# EasyEDA Pro project GController.eprj, schematic GController, sheets 1 to 3 of 4

## Sheets
1 PowerSupply: Create Date: 2024-08-13; Page Name: PowerSupply; Project Name: GController; Schematic Name: GController; Update Date: 2024-08-26; Company: Mark; Drawn: Naren Subburaj; Page Size: A3; Part Number: 001; Reviewed: Naren Subburaj; Version: V0.1
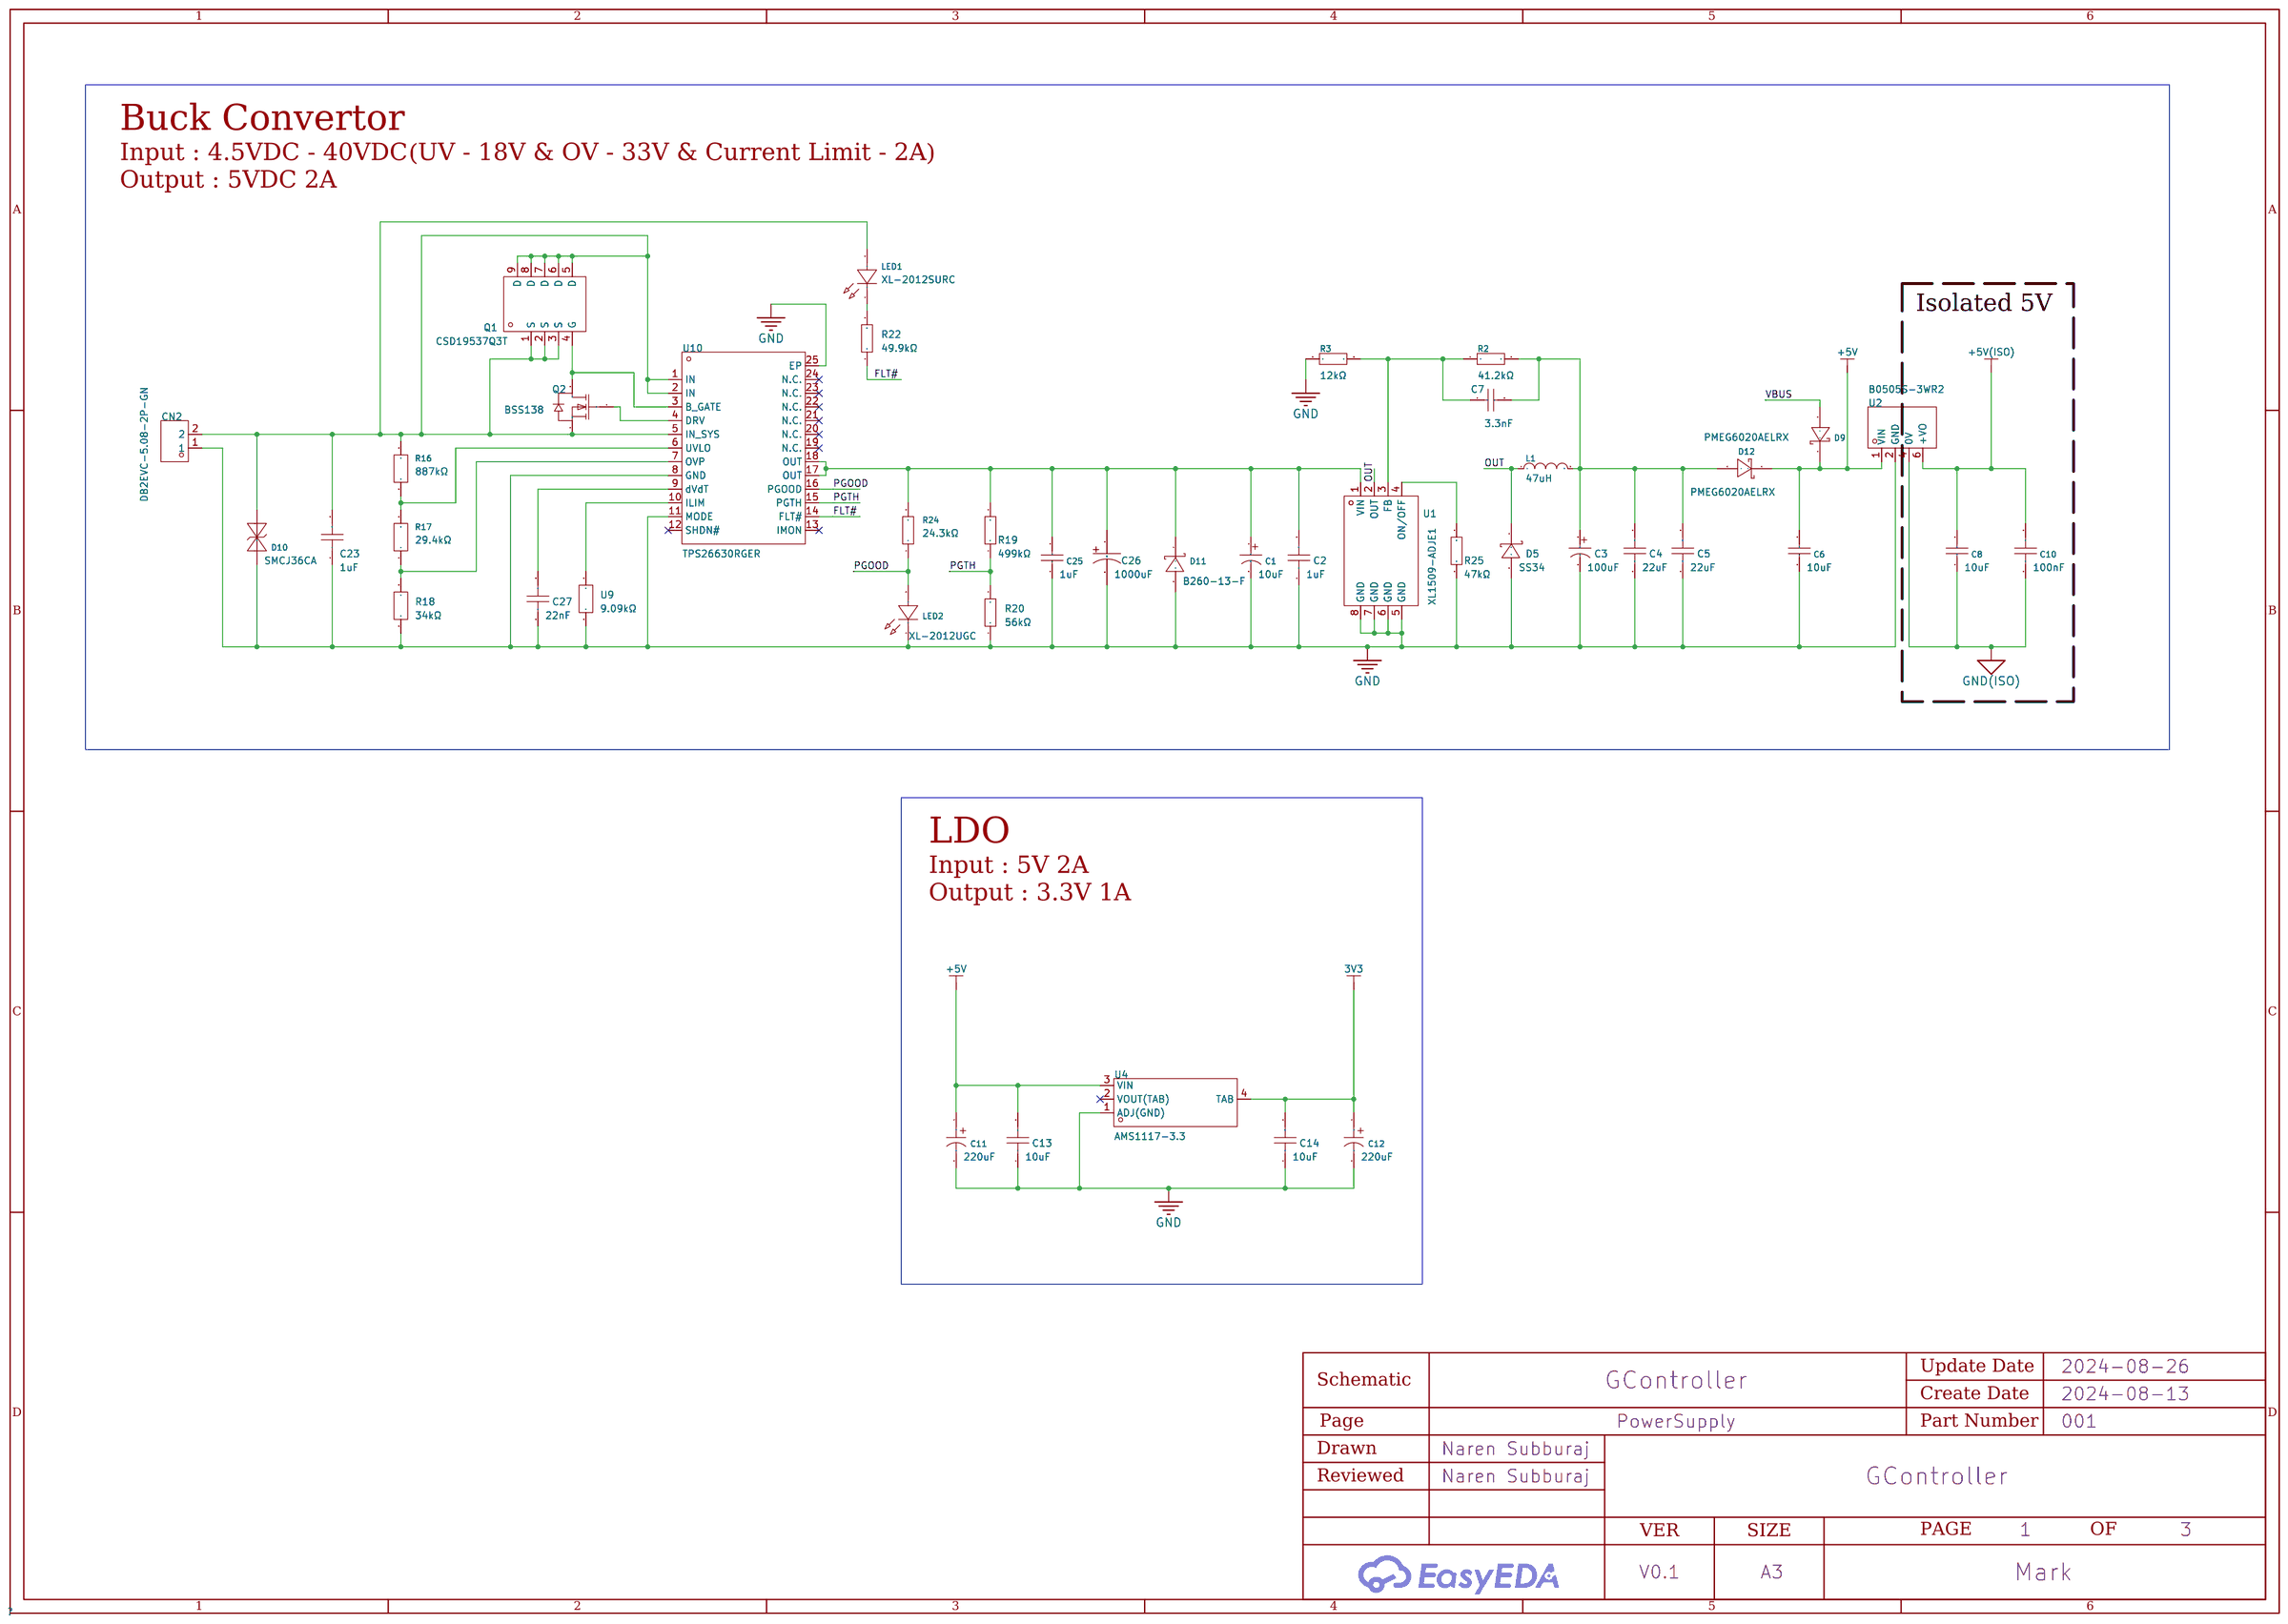
[diagram p0: PowerSupply]
2 ESP32-Display: Create Date: 2024-08-16; Page Name: ESP32-Display; Update Date: 2024-08-28; Part Number: 002
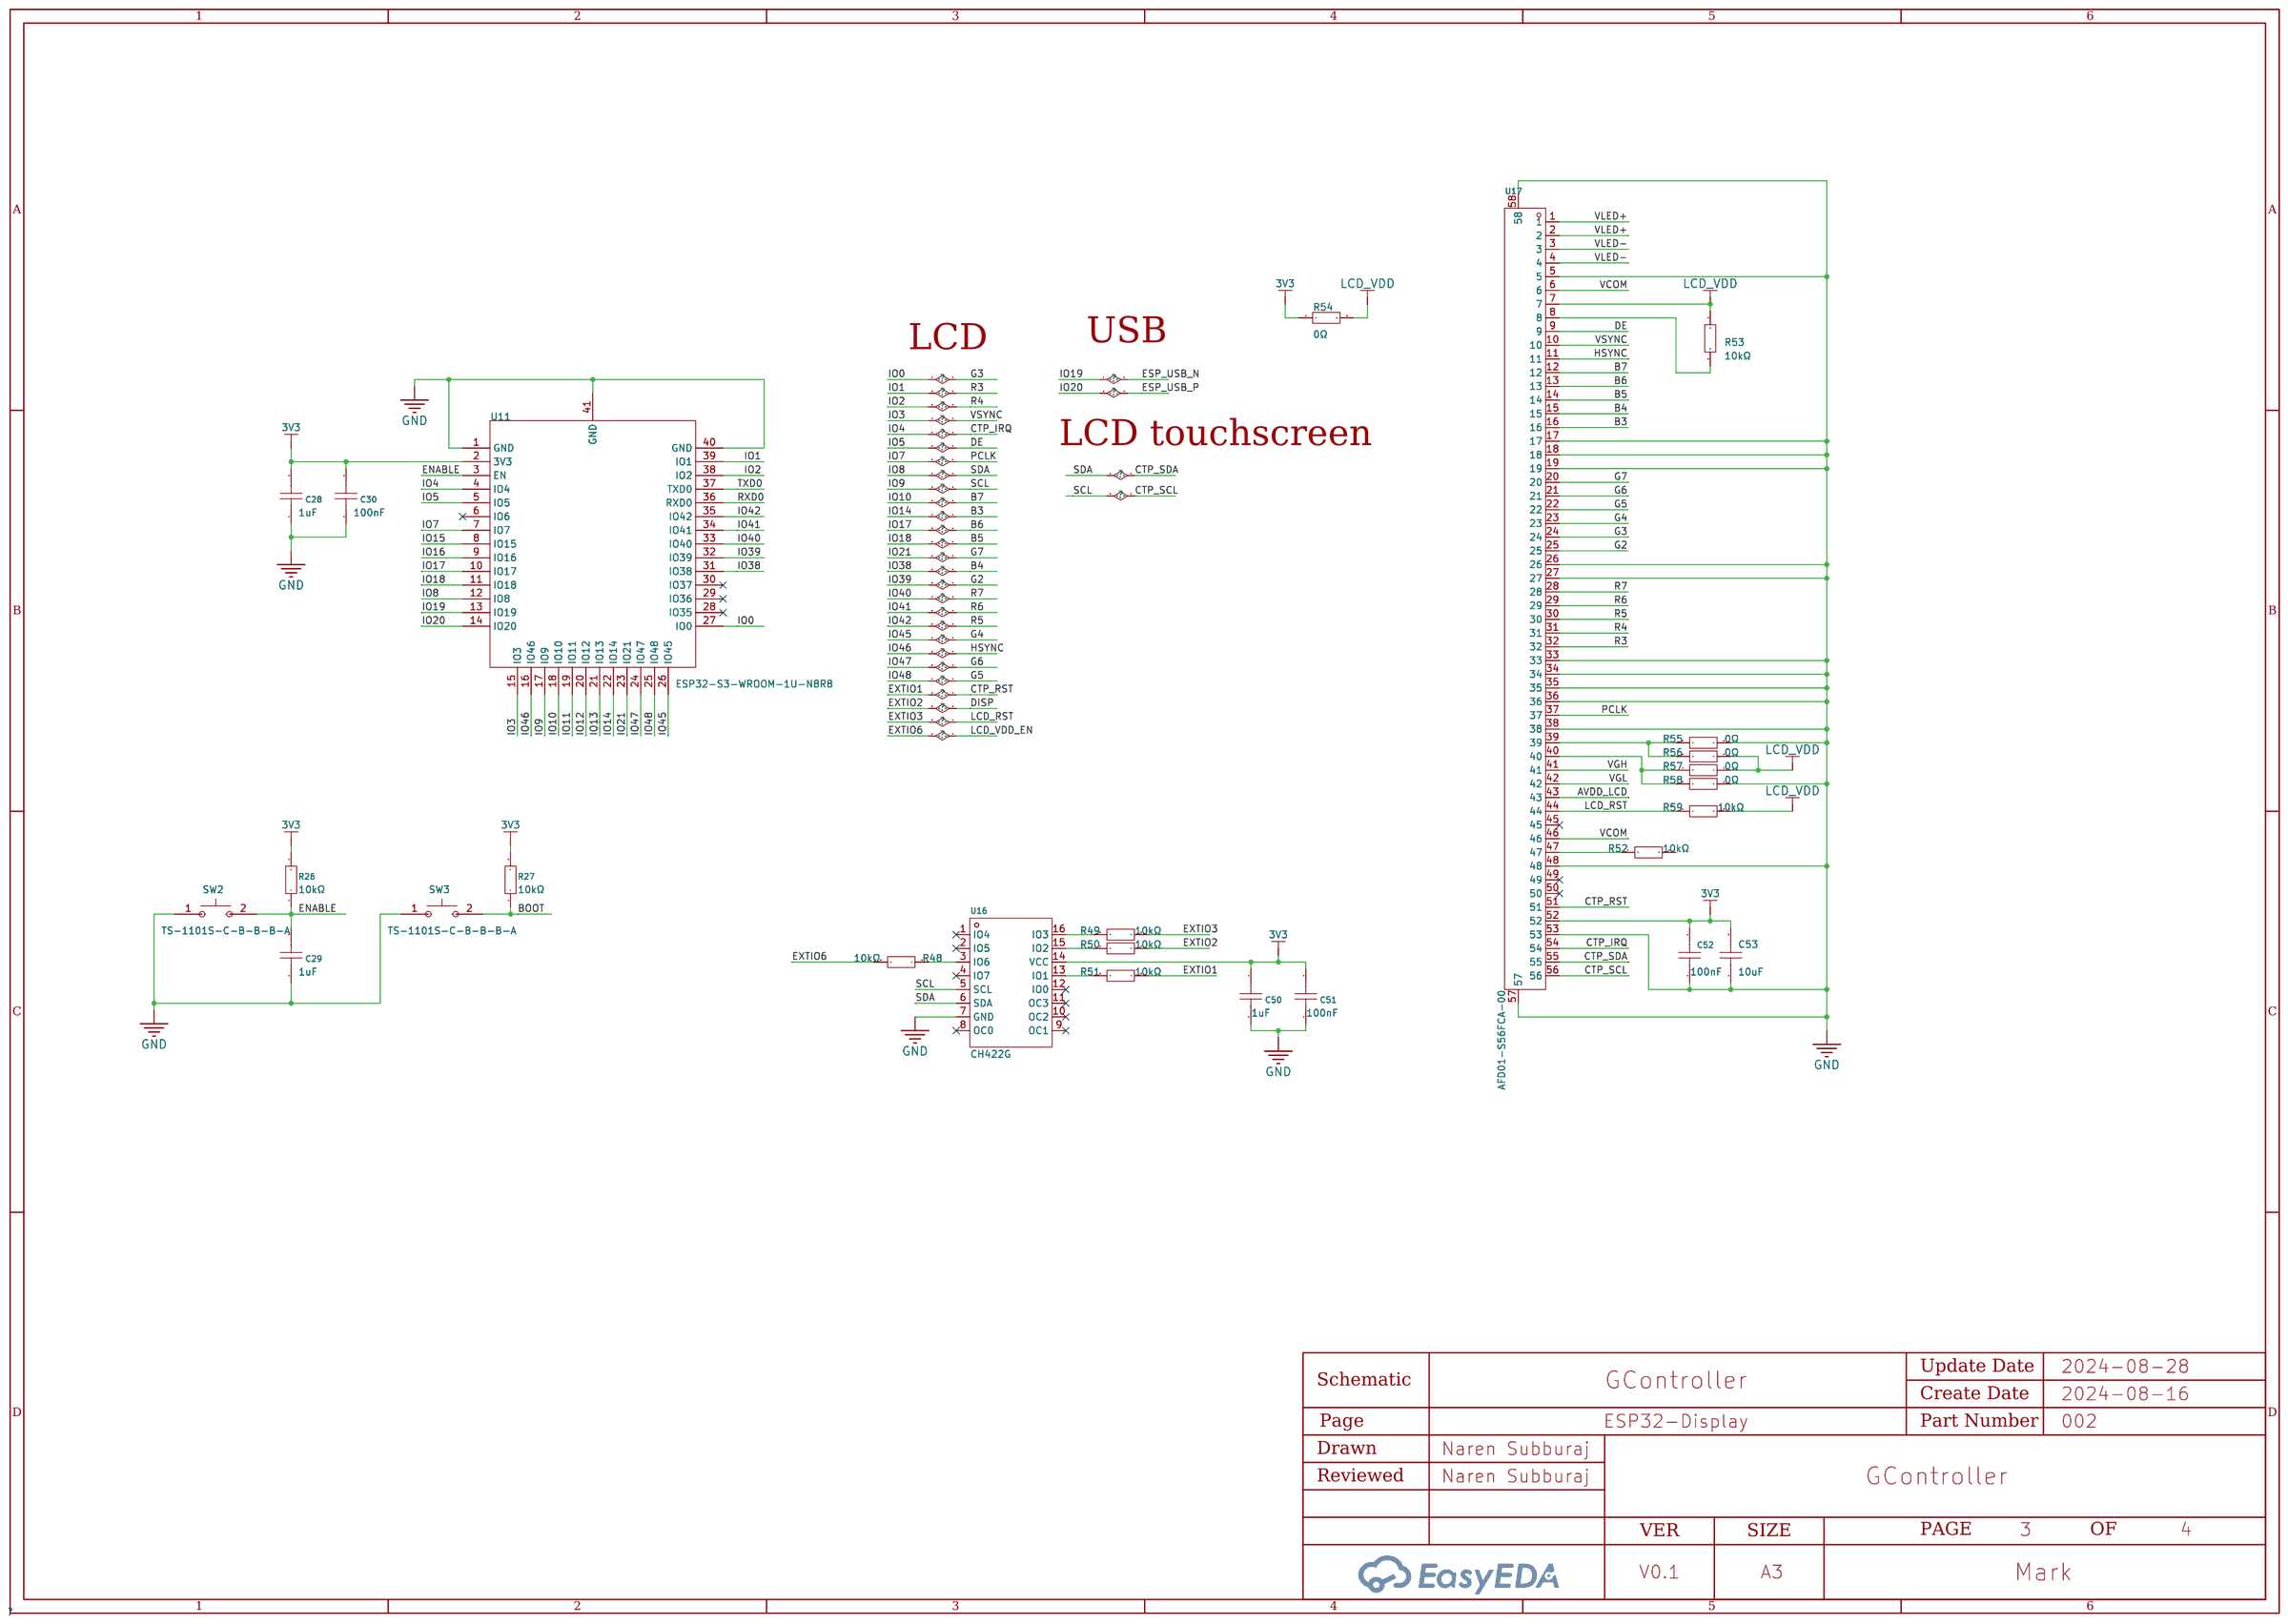
[diagram p1: ESP32-Display]
3 USB: Create Date: 2024-08-16; Page Name: USB; Part Number: 002
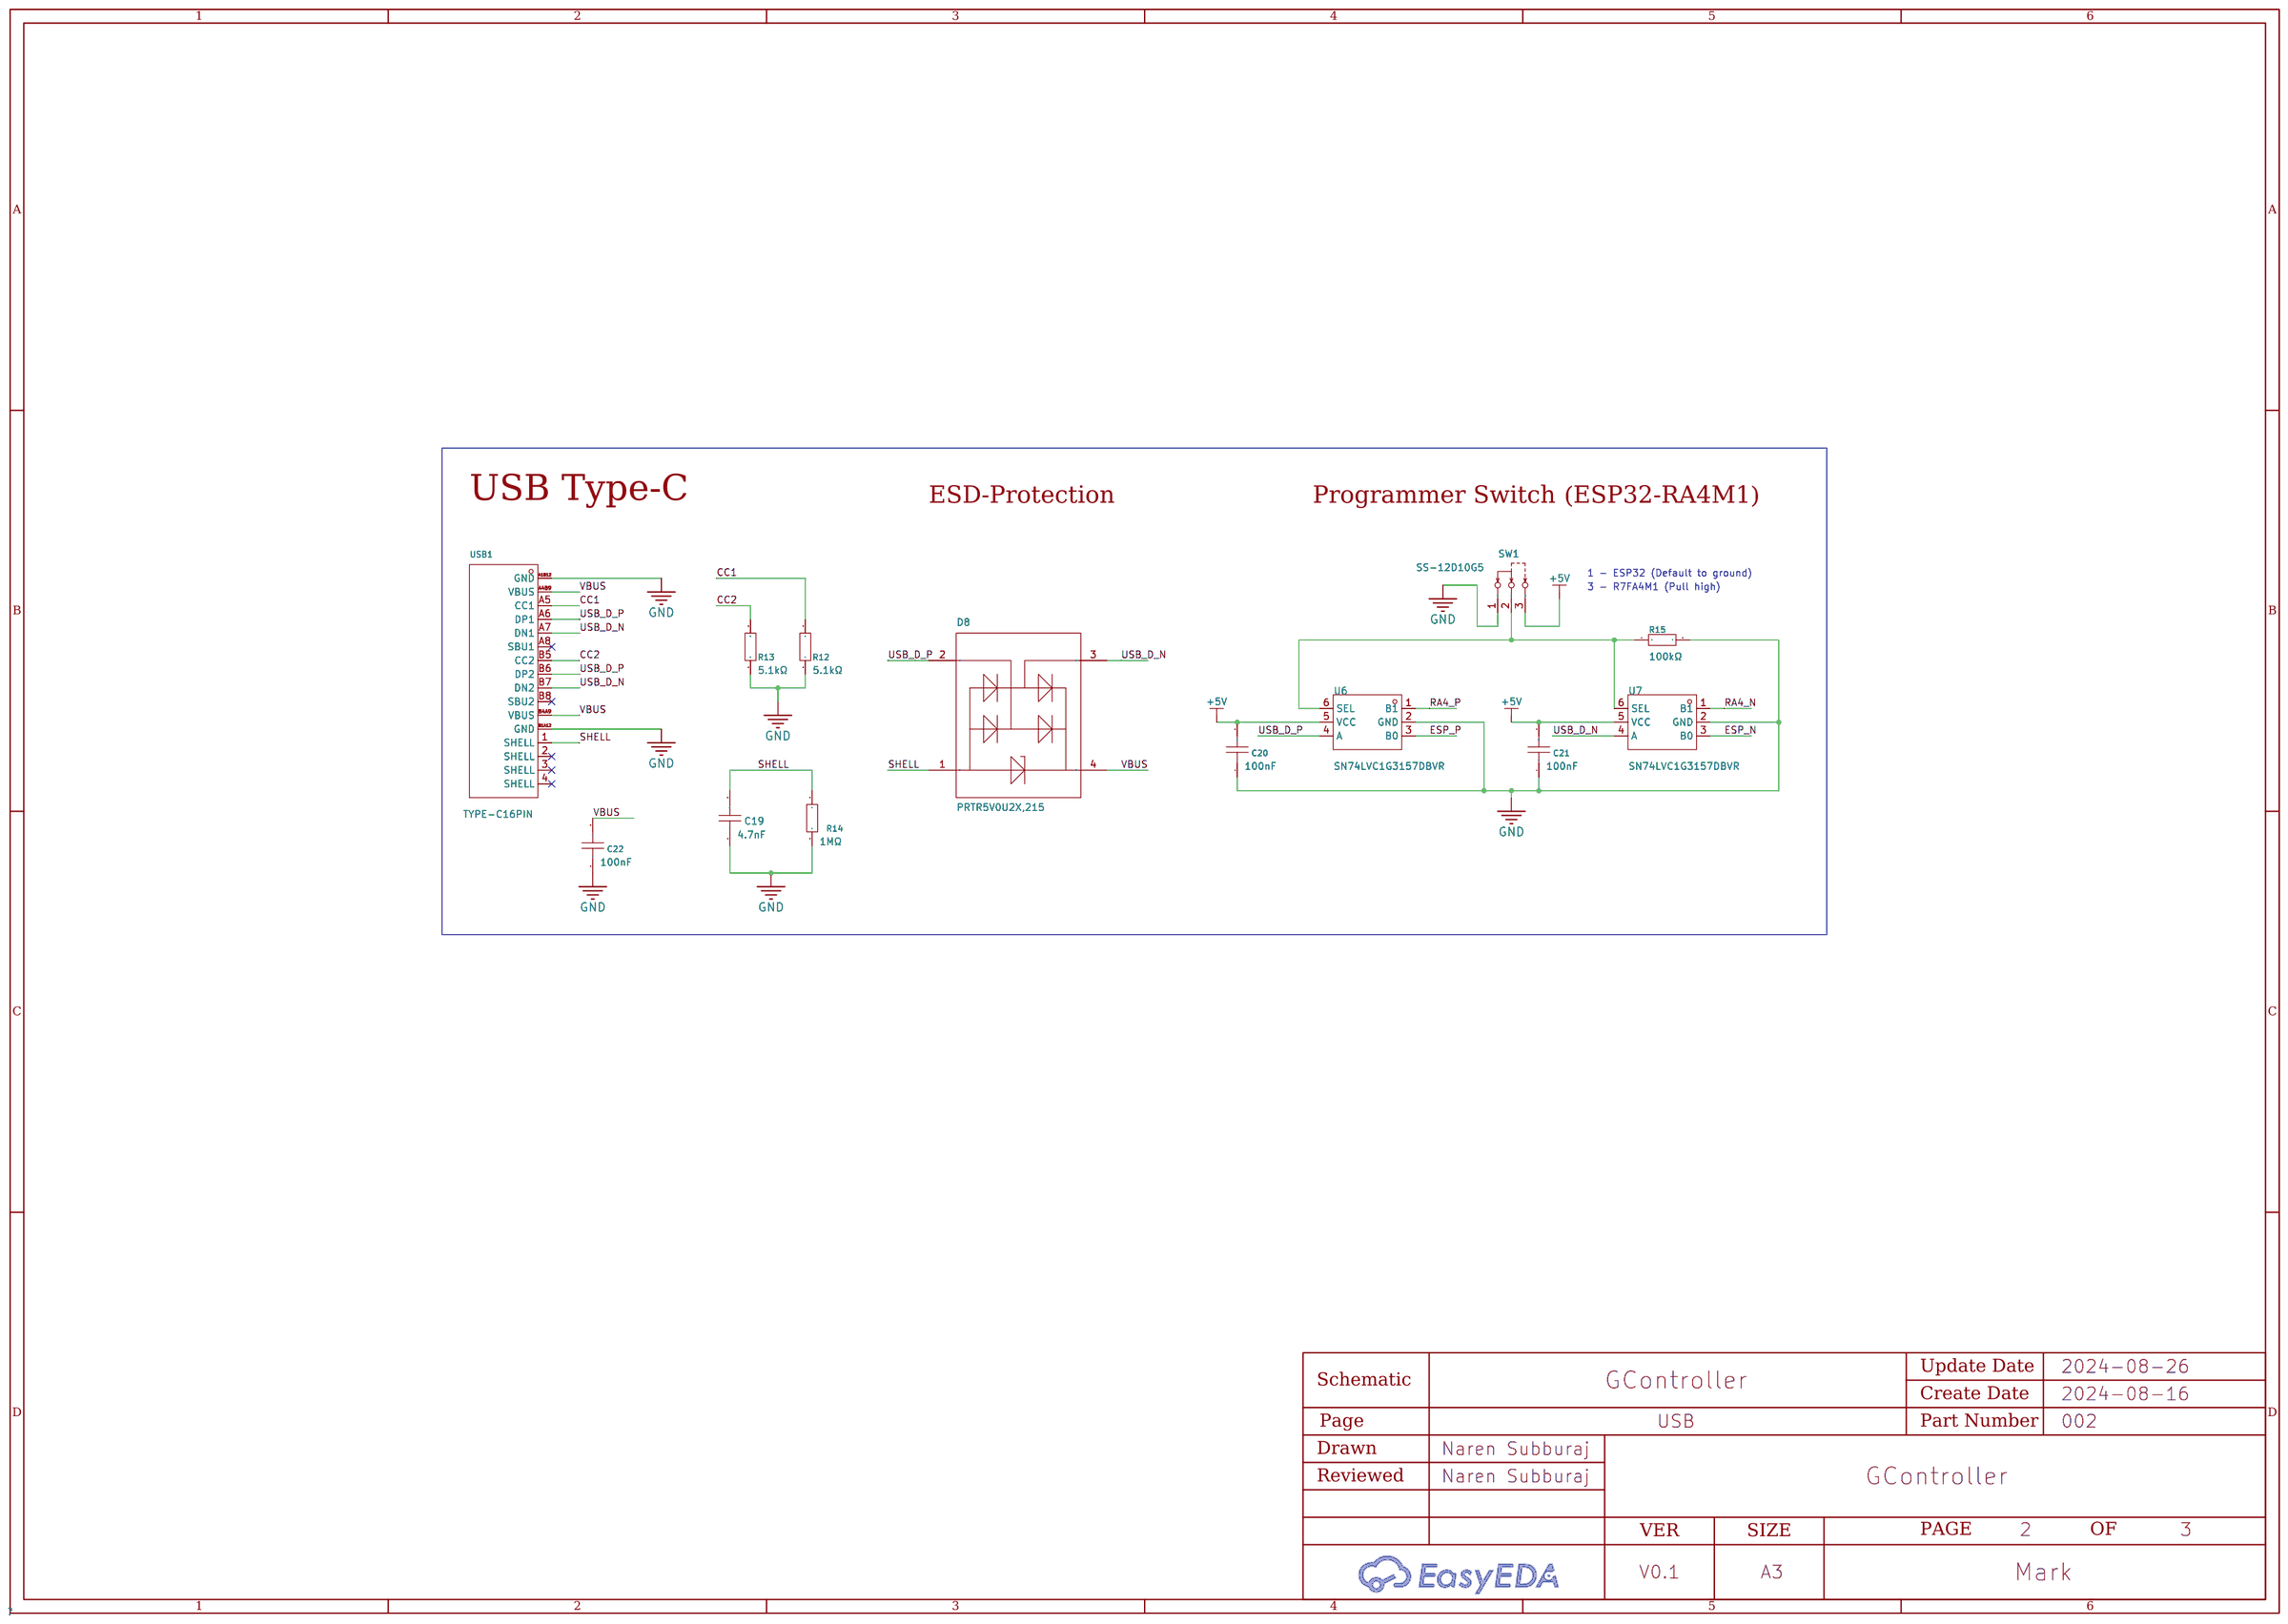
[diagram p2: USB]

## Parts
sheet ESP32-Display
C28  1uF  [C0603]
C29  1uF  [C0603]
C30  100nF  [C0603]
C50  1uF  [C0603]
C51  100nF  [C0603]
C52  100nF  [C0603]
C53  10uF  [C0805]
R26  10kΩ  [R0603]
R27  10kΩ  [R0603]
R48  10kΩ  [R0603]
R49  10kΩ  [R0603]
R50  10kΩ  [R0603]
R51  10kΩ  [R0603]
R52  10kΩ  [R0603]
R53  10kΩ  [R0603]
R54  0Ω  [R0603]
R55  0Ω  [R0603]
R56  0Ω  [R0603]
R57  0Ω  [R0603]
R58  0Ω  [R0603]
R59  10kΩ  [R0603]
SW2  TS-1101S-C-B-B-B-A  [SW-SMD_L6.0-W3.5-LS8.0]
SW3  TS-1101S-C-B-B-B-A  [SW-SMD_L6.0-W3.5-LS8.0]
U11  ESP32-S3-WROOM-1U-N8R8  [WIRELM-SMD_ESP32-S3-WROOM-1U]
U16  CH422G  [SOP-16_L10.0-W3.9-P1.27-LS6.0-BL]
U17  AFD01-S56FCA-00  [FPC-SMD_56P-P0.50_JS_AFD01-S56FCA-00]
sheet PowerSupply
C1  10uF  [CAP-SMD_BD6.3-L6.6-W6.6-FD]
C2  1uF  [C0805]
C3  100uF  [CAP-SMD_BD6.3-L6.6-W6.6-FD]
C4  22uF  [C0805]
C5  22uF  [C0805]
C6  10uF  [C0805]
C7  3.3nF  [C0805]
C8  10uF  [C0805]
C10  100nF  [C0805]
C11  220uF  [CAP-SMD_BD6.3-L6.6-W6.6-LS7.2-FD]
C12  220uF  [CAP-SMD_BD6.3-L6.6-W6.6-LS7.2-FD]
C13  10uF  [C0805]
C14  10uF  [C0805]
C23  1uF  [C0805]
C25  1uF  [C0805]
C26  1000uF  [CAP-TH_BD18.0-P7.50-D0.8-FD]
C27  22nF  [C0805]
CN2  DB2EVC-5.08-2P-GN  [CONN-TH_2P-P5.08_DB2EVC-5.08-2P]
D5  SS34  [SMA_L4.3-W2.6-LS5.2-RD]
D9  PMEG6020AELRX  [SOD-123_L2.6-W1.7-LS3.5-RD]
D10  SMCJ36CA  [SMC_L6.9-W5.9-LS7.9-BI]
D11  B260-13-F  [SMB_L4.6-W3.6-LS5.3-RD]
D12  PMEG6020AELRX  [SOD-123_L2.6-W1.7-LS3.5-RD]
L1  47uH  [IND-SMD_L7.2-W6.6_GPSR07X0]
LED1  XL-2012SURC  [LED0805-RD_RED]
LED2  XL-2012UGC  [LED0805-RD_GREEN]
Q1  CSD19537Q3T  [VSONP-8_L3.3-W3.3-P0.65-BL]
Q2  BSS138  [SOT-23-3_L2.9-W1.3-P1.90-LS2.4-BR]
R2  41.2kΩ  [R0805]
R3  12kΩ  [R0805]
R16  887kΩ  [R0805]
R17  29.4kΩ  [R0805]
R18  34kΩ  [R0805]
R19  499kΩ  [R0805]
R20  56kΩ  [R0805]
R22  49.9kΩ  [R0805]
R24  24.3kΩ  [R0805]
R25  47kΩ  [R0805]
U1  XL1509-ADJE1  [SOIC-8_L5.0-W4.0-P1.27-LS6.0-BL]
U2  B0505S-3WR2  [PWRM-TH_B0505S-3WR2]
U4  AMS1117-3.3  [SOT-223-4_L6.5-W3.5-P2.30-LS7.0-BR]
U9  9.09kΩ  [R0805]
U10  TPS26630RGER  [VQFN-24_L4.0-W4.0-P0.50-TL-EP2.7]
sheet USB
C19  4.7nF  [C0805]
C20  100nF  [C0805]
C21  100nF  [C0805]
C22  100nF  [C0805]
D8  PRTR5V0U2X,215  [SOT-143_L2.9-W1.3-P1.92-LS2.3-BR]
R12  5.1kΩ  [R0805]
R13  5.1kΩ  [R0805]
R14  1MΩ  [R0805]
R15  100kΩ  [R0805]
SW1  SS-12D10G5  [SW-TH_SS-12D10L9]
U6  SN74LVC1G3157DBVR  [SOT-23-6_L2.9-W1.6-P0.95-LS2.8-BL]
U7  SN74LVC1G3157DBVR  [SOT-23-6_L2.9-W1.6-P0.95-LS2.8-BL]
USB1  TYPE-C16PIN  [USB-C-SMD_TYPE-C16PIN]

## Library data of the parts
C28 C29 C50 = C0603X5R105K250NT: Capacitance: Tolerance:±10% Tolerance:±10% Voltage Rated: Temperature Coefficient:; LCSC Part Name: 1uF ±10% 25V; Supplier Part: C466771; Manufacturer: SANYEAR(叁叶源); Supplier Footprint: 0603; JLCPCB Part Class: Extended Part; Datasheet: https://atta.szlcsc.com/upload/public/pdf/source/20200102/C475251_1E30ECAC0E8AE7254982658A02A2D78C.pdf; Supplier: LCSC; Tolerance: ±10%
C30 C51 C52 = CL10B104KB8NNNC: Capacitance: Tolerance:±10% Tolerance:±10% Voltage Rated: Temperature Coefficient:; LCSC Part Name: 100nF ±10% 50V; Supplier Part: C1591; Manufacturer: SAMSUNG(三星); Supplier Footprint: 0603; JLCPCB Part Class: Extended Part; Datasheet: https://atta.szlcsc.com/upload/public/pdf/source/20160218/1457707763339.pdf; Supplier: LCSC; Tolerance: ±10%
C53 = CL21A106KAYNNNE_C15850: Capacitance: Tolerance:±10% Tolerance:±10% Voltage Rated: Temperature Coefficient:; LCSC Part Name: 10uF ±10% 25V; Supplier Part: C15850; Manufacturer: SAMSUNG(三星); Manufacturer Part: CL21A106KAYNNNE; Supplier Footprint: 0805; JLCPCB Part Class: Basic Part; Datasheet: https://atta.szlcsc.com/upload/public/pdf/source/20160218/1457707763339.pdf; Supplier: LCSC; Tolerance: ±10%
R26 R27 = CR0603FA1002G: Type:Thick Film Resistors Resistance: Tolerance:±1% Tolerance:±1% Power(Watts): Overload Voltage (Max): Temperature Coefficient:±100ppm/℃ Temperature Coefficient:±100ppm/℃ Operating Temperature Range:-55℃~+125℃ Operating Temperature Range:-55℃~+125℃; LCSC Part Name: 厚膜电阻 10kΩ ±1% 100mW; Supplier Part: C126901; Manufacturer: LIZ(丽智电子); Supplier Footprint: 0603; JLCPCB Part Class: Extended Part; Datasheet: https://atta.szlcsc.com/upload/public/pdf/source/20180403/C189438_6D658388CC7843F35BBC9018D03F0B8E.pdf; Supplier: LCSC; Type: Thick Film Resistors; Tolerance: ±1%; Temperature Coefficient: ±100ppm/℃; Operating Temperature Range: -55℃~+125℃
R48-R53 R59 = RC0603FR-0710KL: Type:Thick Film Resistors Resistance: Tolerance:±1% Tolerance:±1% Power(Watts): Overload Voltage (Max): Temperature Coefficient:±100ppm/℃ Temperature Coefficient:±100ppm/℃ Operating Temperature Range:-55℃~+155℃ Operating Temperature Range:-55℃~+155℃; LCSC Part Name: 厚膜电阻 10kΩ ±1% 100mW; Supplier Part: C98220; Manufacturer: YAGEO(国巨); Supplier Footprint: 0603; JLCPCB Part Class: Extended Part; Datasheet: https://atta.szlcsc.com/upload/public/pdf/source/20180927/C295883_E8D83085EA81BD7DE0B2B681138C15EE.pdf; Supplier: LCSC; Type: Thick Film Resistors; Tolerance: ±1%; Temperature Coefficient: ±100ppm/℃; Operating Temperature Range: -55℃~+155℃
R54-R58 = MR06X000PTL: Type:Thick Film Resistors Resistance: Power(Watts): Overload Voltage (Max): Temperature Coefficient:-200ppm/℃~+400ppm/℃ Temperature Coefficient:-200ppm/℃~+400ppm/℃ Operating Temperature Range:-55℃~+155℃ Operating Temperature Range:-55℃~+155℃; LCSC Part Name: 厚膜电阻 0Ω 125mW; Supplier Part: C327824; Manufacturer: Walsin(华新科); Supplier Footprint: 0603; JLCPCB Part Class: Extended Part; Datasheet: https://atta.szlcsc.com/upload/public/pdf/source/20190927/C431928_EFD0274D1DCD4BC1E8C9515D468AAF68.pdf; Supplier: LCSC; Type: Thick Film Resistors; Temperature Coefficient: -200ppm/℃~+400ppm/℃; Operating Temperature Range: -55℃~+155℃
SW2 SW3 = TS-1101S-C-B-B-B-A: Circuit:SPST Actuator Style:Rectangle button Operating Force:260gf Mounting Style:Brick nogging Switch Length:6mm Switch Width:3.5mm Switch Height:5mm Strike Gundam:不带 Contact Current:50mA Voltage Rating (DC):12V Insulation Resistance:- Actuator/Cap Color; LCSC Part Name: 6*3.5*5mm 立贴 轻触开关; Supplier Part: C609852; Manufacturer: XKB Connectivity(中国星坤); Supplier Footprint: SMD; JLCPCB Part Class: Extended Part; Datasheet: https://atta.szlcsc.com/upload/public/pdf/source/20211011/FB5BEC18F2E7B990941A3F47A2FD4F18.pdf; Supplier: LCSC; Circuit: SPST; Actuator Style: Rectangle button; Operating Force: 260gf; Mounting Style: Brick nogging; Switch Length: 6mm; Switch Width: 3.5mm; Switch Height: 5mm; Strike Gundam: 不带; Contact Current: 50mA; Voltage Rating (DC): 12V; Actuator/Cap Color: Black; With Lamp: No; Mechanical Life: 5万次; Operating Temperature: -20℃~+70℃
U11 = ESP32-S3-WROOM-1U-N8R8: LCSC Part Name: 通用型Wi-Fi+低功耗蓝牙MCU模组; Supplier Part: C2980300; Manufacturer: ESPRESSIF(乐鑫); Supplier Footprint: SMD,18x19.2mm; JLCPCB Part Class: Extended Part; Datasheet: https://atta.szlcsc.com/upload/public/pdf/source/20220628/A2AC12B3C87735CAEB7EBE2DBE80936C.pdf; Supplier: LCSC
U16 = CH422G: Interface:I2C； Number of I/O:8 Interrupt Output:无中断输出 Output Type: Supply Voltage:3V~5V Supply Voltage:3V~5V Clock Frequency:1MHz Operating Temperature:-40℃~+85℃ Operating Temperature:-40℃~+85℃; LCSC Part Name: 数码管显示驱动及 I/O 扩展芯片; Supplier Part: C57543; Manufacturer: WCH(南京沁恒); Supplier Footprint: SOP-16; JLCPCB Part Class: Extended Part; Datasheet: https://atta.szlcsc.com/upload/public/pdf/source/20170818/C57543_1503051309697895383.PDF; Supplier: LCSC; Interface: I2C；; Number of I/O: 8; Interrupt Output: 无中断输出; Supply Voltage: 3V~5V; Clock Frequency: 1MHz; Operating Temperature: -40℃~+85℃
U17 = AFD01-S56FCA-00: Locking Feature:Clamshell Contact Type:Bottom Contact Number of Contacts:56P Pitch:0.5mm Mounting Type:卧贴 Height Above Board:2mm; LCSC Part Name: 间距:0.5mm P数:56P 翻盖式 下接; Supplier Part: C18198615; Manufacturer: JS(钜硕电子); Supplier Footprint: SMD,P=0.5mm,卧贴; JLCPCB Part Class: Extended Part; Datasheet: https://atta.szlcsc.com/upload/public/pdf/source/20230921/C984413AEFF3A883511B509B58F9A1F7.pdf; Supplier: LCSC; Locking Feature: Clamshell; Contact Type: Bottom Contact; Number of Contacts: 56P; Pitch: 0.5mm; Mounting Type: 卧贴; Height Above Board: 2mm
C1 = RVT2A100M0607_C72482: Capacitance: Tolerance:±20% Tolerance:±20% Rated Voltage: Ripple Current:38mA@120Hz Equivalent Series Resistance(ESR):- φD: L: Lifetime @ Temp:2000hrs@105℃ Operating Temperature:-40℃~+105℃ Operating Temperature:-40℃~+105℃; LCSC Part Name: 10uF ±20% 100V; Supplier Part: C72482; Manufacturer: ROQANG(容强); Manufacturer Part: RVT2A100M0607; Supplier Footprint: SMD,D6.3xL7.7mm; JLCPCB Part Class: Extended Part; Datasheet: https://atta.szlcsc.com/upload/public/pdf/source/20170325/1490427950282.pdf; Supplier: LCSC; Tolerance: ±20%; Ripple Current: 38mA@120Hz; Lifetime @ Temp: 2000hrs@105℃; Operating Temperature: -40℃~+105℃
C2 = 0805B105K500NT_C215803: Capacitance:1uF Tolerance:±10% Tolerance:±10% Voltage Rated: Temperature Coefficient:; LCSC Part Name: 1uF ±10% 50V; Supplier Part: C215803; Manufacturer: FH(风华); Manufacturer Part: 0805B105K500NT; Supplier Footprint: 0805; JLCPCB Part Class: Extended Part; Datasheet: https://atta.szlcsc.com/upload/public/pdf/source/20180530/C215803_D57791C2287FC18831C4E0C7838E6BEC.pdf; Supplier: LCSC; Tolerance: ±10%
C3 = UWX1C101MCL1GB: Capacitance: Tolerance:±20% Tolerance:±20% Rated Voltage: Ripple Current:129mA@10kHz Equivalent Series Resistance(ESR):- φD:- L:- Lifetime @ Temp:2000hrs@85℃ Operating Temperature:-40℃~+85℃ Operating Temperature:-40℃~+85℃; LCSC Part Name: 100uF ±20% 16V; Supplier Part: C111600; Manufacturer: Nichicon(尼吉康); Supplier Footprint: SMD,D6.3xL5.4mm; JLCPCB Part Class: Extended Part; Datasheet: https://atta.szlcsc.com/upload/public/pdf/source/20170511/1494500117761.pdf; Supplier: LCSC; Tolerance: ±20%; Ripple Current: 129mA@10kHz; Lifetime @ Temp: 2000hrs@85℃; Operating Temperature: -40℃~+85℃
C4 C5 = CL21A226KOQNNNE: Capacitance: Tolerance:±10% Tolerance:±10% Voltage Rated: Temperature Coefficient:; LCSC Part Name: 22uF ±10% 16V; Supplier Part: C296720; Manufacturer: SAMSUNG(三星); Supplier Footprint: 0805; JLCPCB Part Class: Extended Part; Datasheet: https://atta.szlcsc.com/upload/public/pdf/source/20160218/1457707763339.pdf; Supplier: LCSC; Tolerance: ±10%
C6 C8 = CL21A106KOQNNNE: Capacitance: Tolerance:±10% Tolerance:±10% Voltage Rated: Temperature Coefficient:; LCSC Part Name: 10uF ±10% 16V; Supplier Part: C1713; Manufacturer: SAMSUNG(三星); Supplier Footprint: 0805; JLCPCB Part Class: Extended Part; Datasheet: https://atta.szlcsc.com/upload/public/pdf/source/20160218/1457707763339.pdf; Supplier: LCSC; Tolerance: ±10%
C7 = 0805B332K500NT: Capacitance:3.3nF Tolerance:±10% Tolerance:±10% Voltage Rated: Temperature Coefficient:; LCSC Part Name: 3.3nF ±10% 50V; Supplier Part: C1738; Manufacturer: FH(风华); Supplier Footprint: 0805; JLCPCB Part Class: Extended Part; Datasheet: https://atta.szlcsc.com/upload/public/pdf/source/20200305/C486355_26A10D38EF8C2A5C37091D0039909270.pdf; Supplier: LCSC; Tolerance: ±10%
C10 C20-C22 = C0805B104K500NT: Capacitance: Tolerance:±10% Tolerance:±10% Voltage Rated: Temperature Coefficient:; LCSC Part Name: 100nF ±10% 50V; Supplier Part: C476766; Manufacturer: TORCH(火炬); Supplier Footprint: 0805; JLCPCB Part Class: Extended Part; Datasheet: https://atta.szlcsc.com/upload/public/pdf/source/20191230/C476766_171E30D5B7F7164A8210B8E948DFBAE0.pdf; Supplier: LCSC; Tolerance: ±10%
C11 C12 = MVG 16V 220UF 6.3*7.7: Capacitance: Tolerance:±20% Tolerance:±20% Rated Voltage: Ripple Current:130mA@120Hz Equivalent Series Resistance(ESR):- φD: L: Lifetime @ Temp:2000hrs@85℃ Operating Temperature:-40℃~+85℃ Operating Temperature:-40℃~+85℃; LCSC Part Name: 220uF ±20% 16V; Supplier Part: C2827940; Manufacturer: SAMYOUNG(韩国三莹); Supplier Footprint: SMD,D6.3xL7.7mm; JLCPCB Part Class: Extended Part; Datasheet: https://atta.szlcsc.com/upload/public/pdf/source/20210425/C2827940_BA294F4A0B6335BFB3E0A33EED85EEAA.pdf; Supplier: LCSC; Tolerance: ±20%; Ripple Current: 130mA@120Hz; Lifetime @ Temp: 2000hrs@85℃; Operating Temperature: -40℃~+85℃
C13 C14 = 0805F106M160NT: Capacitance:10uF Tolerance:±20% Tolerance:±20% Voltage Rated: Temperature Coefficient:; LCSC Part Name: 10uF ±20% 16V; Supplier Part: C90545; Manufacturer: FH(风华); Supplier Footprint: 0805; JLCPCB Part Class: Extended Part; Datasheet: https://atta.szlcsc.com/upload/public/pdf/source/20200305/C486355_26A10D38EF8C2A5C37091D0039909270.pdf; Supplier: LCSC; Tolerance: ±20%
C23 = CC0805KKX5R9BB105: Capacitance: Tolerance:±10% Tolerance:±10% Voltage Rated: Temperature Coefficient:; LCSC Part Name: 1uF ±10% 50V; Supplier Part: C519978; Manufacturer: YAGEO(国巨); Supplier Footprint: 0805; JLCPCB Part Class: Extended Part; Datasheet: https://atta.szlcsc.com/upload/public/pdf/source/20200423/C519978_1AB07F58D3AD03F59799650436EEADDD.pdf; Supplier: LCSC; Tolerance: ±10%
C25 = C0805X105K101T: Capacitance: Tolerance:±10% Tolerance:±10% Voltage Rated: Temperature Coefficient:; LCSC Part Name: 1uF ±10% 100V; Supplier Part: C105952; Manufacturer: IHHEC(禾伸堂); Supplier Footprint: 0805; JLCPCB Part Class: Extended Part; Datasheet: https://atta.szlcsc.com/upload/public/pdf/source/20190320/C382566_48A8BC751273AF8DDA8B4D7D5A4AAF28.pdf; Supplier: LCSC; Tolerance: ±10%
C26 = 100PX1000MEFC18X35.5: Capacitance: Tolerance:±20% Tolerance:±20% Rated Voltage: Ripple Current:950mA@100kHz Equivalent Series Resistance(ESR):- Lead Spacing: φD: L: Lifetime @ Temp:2000hrs@105℃ Operating Temperature:-25℃~+105℃ Operating Temperature:-25℃~+105℃; LCSC Part Name: 1000uF ±20% 100V; Supplier Part: C338162; Manufacturer: rubycon(红宝石); Supplier Footprint: 插件,D18xL35.5mm; JLCPCB Part Class: Extended Part; Datasheet: https://atta.szlcsc.com/upload/public/pdf/source/20181130/C338162_4822EACAD781099B2CF236768927AEF7.pdf; Supplier: LCSC; Tolerance: ±20%; Ripple Current: 950mA@100kHz; Lifetime @ Temp: 2000hrs@105℃; Operating Temperature: -25℃~+105℃
C27 = 0805B223K101NT: Capacitance:22nF Tolerance:±10% Tolerance:±10% Voltage Rated: Temperature Coefficient:; LCSC Part Name: 22nF ±10% 100V; Supplier Part: C507048; Manufacturer: FH(风华); Supplier Footprint: 0805; JLCPCB Part Class: Extended Part; Datasheet: https://atta.szlcsc.com/upload/public/pdf/source/20200305/C486355_26A10D38EF8C2A5C37091D0039909270.pdf; Supplier: LCSC; Tolerance: ±10%
CN2 = DB2EVC-5.08-2P-GN: Connector Type:板端/Receptacle-Close fixed form:- Structure:1x2P Pitch:5.08mm Color:Green Mounting Style:直针 Number of Pins:2P Number of Rows:1 Number of PINs Per Row:2 Current Rating (Max):15A Voltage Rating (Max):320V Wire Gauge - AWG:- Wire Gauge - AWG:-; LCSC Part Name: 1x2P 5.08mm 排数:1 每排P数:2; Supplier Part: C395734; Manufacturer: DORABO(地博电气); Supplier Footprint: 插件,P=5.08mm; JLCPCB Part Class: Extended Part; Datasheet: https://atta.szlcsc.com/upload/public/pdf/source/20230327/6B6635D5CE39DCA8EEC0A6807DD2787F.pdf; Supplier: LCSC; Connector Type: 板端/Receptacle-Close; Structure: 1x2P; Pitch: 5.08mm; Color: Green; Mounting Style: 直针; Number of Pins: 2P; Number of Rows: 1; Number of PINs Per Row: 2; Current Rating (Max): 15A; Voltage Rating (Max): 320V; Operating Temperature Range: -40℃~+105℃
D5 = SS34_C8678: Diode Configuration:Single Forward Voltage (Vf@If):550mV@3A Reverse Voltage (Vr):40V Rectified Current:3A Reverse Leakage Current (Ir):500uA@40V; LCSC Part Name: 电压:40V 电流:3A; Supplier Part: C8678; Manufacturer: MDD(辰达半导体); Supplier Footprint: SMA(DO-214AC); JLCPCB Part Class: Basic Part; Datasheet: https://atta.szlcsc.com/upload/public/pdf/source/20230314/A80AE34493C69B89E2F4B1712F433538.pdf; Supplier: LCSC; Diode Configuration: Single; Forward Voltage (Vf@If): 550mV@3A; Reverse Voltage (Vr): 40V; Rectified Current: 3A; Reverse Leakage Current (Ir): 500uA@40V
D9 D12 = PMEG6020AELRX: Forward Voltage (Vf@If):670mV@2A Reverse Voltage (Vr):60V Average Rectified Current (Io):2A Reverse Leakage Current (Ir):700nA@60V; LCSC Part Name: 电压:60V 电流:2A; Supplier Part: C552938; Manufacturer: Nexperia(安世); Supplier Footprint: SOD-123W; JLCPCB Part Class: Extended Part; Datasheet: https://atta.szlcsc.com/upload/public/pdf/source/20200610/C552938_B8C7D9A5A76F9EEA08B29DEA3727CBD6.pdf; Supplier: LCSC; Forward Voltage (Vf@If): 670mV@2A; Reverse Voltage (Vr): 60V; Average Rectified Current (Io): 2A; Reverse Leakage Current (Ir): 700nA@60V
D10 = SMCJ36CA_C2831485: Reverse Stand-Off Voltage (Vrwm):36V Maximum Clamping Voltage:44.2V Peak Pulse Current (Ipp)@10/1000us:25.9A Peak Pulse Power Dissipation (Ppp)@10/1000us:1.5kW Breakdown Voltage:40V Reverse Leakage Current (Ir):1uA Type:TVS; Supplier Part: C2831485; Manufacturer: BOURNS; Supplier Footprint: DO-214AB(SMC); JLCPCB Part Class: Extended Part; Datasheet: https://atta.szlcsc.com/upload/public/pdf/source/20210426/6F9CAED0CDF5A5E1612B236CFE13E411.pdf; Supplier: LCSC; Reverse Stand-Off Voltage (Vrwm): 36V; Maximum Clamping Voltage: 44.2V; Peak Pulse Current (Ipp)@10/1000us: 25.9A; Peak Pulse Power Dissipation (Ppp)@10/1000us: 1.5kW; Breakdown Voltage: 40V; Reverse Leakage Current (Ir): 1uA; Type: TVS
D11 = B260-13-F: Forward Voltage (Vf@If):700mV@2A Reverse Voltage (Vr):60V Average Rectified Current (Io):2A Reverse Leakage Current (Ir):500uA@60V; LCSC Part Name: 电压:60V 电流:2A; Supplier Part: C72265; Manufacturer: DIODES(美台); Supplier Footprint: SMB(DO-214AA); JLCPCB Part Class: Extended Part; Datasheet: https://atta.szlcsc.com/upload/public/pdf/source/20191129/C460673_65E0A67BF9F553882F22D2B39F8BCAEF.pdf; Supplier: LCSC; Forward Voltage (Vf@If): 700mV@2A; Reverse Voltage (Vr): 60V; Average Rectified Current (Io): 2A; Reverse Leakage Current (Ir): 500uA@60V
L1 = CYA0650-47UH: Inductance: Tolerance:±20% Tolerance:±20% Rated Current:2A DC Resistance (DCR):; LCSC Part Name: 47uH ±20%; Supplier Part: C5189938; Manufacturer: SHOU HAN(首韩); Supplier Footprint: SMD,7.2x6.6mm; JLCPCB Part Class: Extended Part; Datasheet: https://atta.szlcsc.com/upload/public/pdf/source/20221010/187A244A1C035AF94CD50603D8F233D2.pdf; Supplier: LCSC; Tolerance: ±20%; Rated Current: 2A
LED1 = XL-2012SURC: Emitted Color:Red Power Dissipation:55mW Forward Current:25mA Dominant Wavelength:617nm~621nm Dominant Wavelength:617nm~621nm Peak Wavelength:623nm Lens Color:无色透明透镜 Color Temperature:- Color Temperature:- Viewing Angle:120° Mounting Sytle:Positive post O; Supplier Part: C965812; Manufacturer: XINGLIGHT(成兴光); Supplier Footprint: 0805; JLCPCB Part Class: Extended Part; Datasheet: https://atta.szlcsc.com/upload/public/pdf/source/20221102/49E1A0A365644091E6270AF1C5E0FE37.pdf; Supplier: LCSC; Emitted Color: Red; Power Dissipation: 55mW; Forward Current: 25mA; Dominant Wavelength: 617nm~621nm; Peak Wavelength: 623nm; Lens Color: 无色透明透镜; Viewing Angle: 120°; Mounting Sytle: Positive post; Operating Temperature: -30℃~+85℃
LED2 = XL-2012UGC: Emitted Color:Emerald Power Dissipation:80mW Forward Current:25mA Dominant Wavelength:516nm~525nm Dominant Wavelength:516nm~525nm Peak Wavelength:534nm Lens Color:无色透明透镜 Color Temperature:- Color Temperature:- Viewing Angle:120° Mounting Sytle:Positive po; Supplier Part: C965815; Manufacturer: XINGLIGHT(成兴光); Supplier Footprint: 0805; JLCPCB Part Class: Extended Part; Datasheet: https://atta.szlcsc.com/upload/public/pdf/source/20221102/ACA6CBC413A1A8AF38BEBA54306464BE.pdf; Supplier: LCSC; Emitted Color: Emerald; Power Dissipation: 80mW; Forward Current: 25mA; Dominant Wavelength: 516nm~525nm; Peak Wavelength: 534nm; Lens Color: 无色透明透镜; Viewing Angle: 120°; Mounting Sytle: Positive post; Operating Temperature: -30℃~+85℃
Q1 = CSD19537Q3T: Type:1个NChannel Drain Source Voltage (Vdss): Continuous Drain Current (Id): Power Dissipation (Pd): Drain Source On Resistance (RDS(on)@Vgs,Id):14.5mΩ@10V,10A Gate Threshold Voltage (Vgs(th)@Id):3.6V@250uA; LCSC Part Name: 1个N沟道 耐压:100V 电流:50A; Supplier Part: C134143; Manufacturer: TI(德州仪器); Supplier Footprint: VSONP-8(3.3x3.3); JLCPCB Part Class: Extended Part; Datasheet: https://www.ti.com/cn/lit/gpn/csd19537q3; Supplier: LCSC; Type: 1个NChannel; Drain Source On Resistance (RDS(on)@Vgs,Id): 14.5mΩ@10V,10A; Gate Threshold Voltage (Vgs(th)@Id): 3.6V@250uA
Q2 = BSS138_C489349: Type:1个NChannel Drain Source Voltage (Vdss): Continuous Drain Current (Id): Power Dissipation (Pd): Drain Source On Resistance (RDS(on)@Vgs,Id):2.5Ω@10V,220mA Gate Threshold Voltage (Vgs(th)@Id):1.5V@250uA; LCSC Part Name: 1个N沟道 耐压:50V 电流:300mA; Supplier Part: C489349; Manufacturer: KEXIN(科信); Supplier Footprint: SOT-23; JLCPCB Part Class: Extended Part; Datasheet: https://atta.szlcsc.com/upload/public/pdf/source/20200225/C489349_F11039DA064D6FF18A45C7D002538134.pdf; Supplier: LCSC; Type: 1个NChannel; Drain Source On Resistance (RDS(on)@Vgs,Id): 2.5Ω@10V,220mA; Gate Threshold Voltage (Vgs(th)@Id): 1.5V@250uA
R2 = 0805W8F4122T5E: Type:Thick Film Resistors Resistance:41.2kΩ Tolerance:±1% Tolerance:±1% Power(Watts): Overload Voltage (Max): Temperature Coefficient:±100ppm/℃ Temperature Coefficient:±100ppm/℃ Operating Temperature Range:-55℃~+155℃ Operating Temperature Range:-55℃~+155℃; LCSC Part Name: 41.2kΩ ±1% 125mW 厚膜电阻; Supplier Part: C17682; Manufacturer: UNI-ROYAL(厚声); Supplier Footprint: 0805; JLCPCB Part Class: Extended Part; Datasheet: https://atta.szlcsc.com/upload/public/pdf/source/20200306/C422600_1E6D84923E4A46A82E41ADD87F860B5C.pdf; Supplier: LCSC; Type: Thick Film Resistors; Tolerance: ±1%; Temperature Coefficient: ±100ppm/℃; Operating Temperature Range: -55℃~+155℃
R3 = 0805W8F1202T5E: Type:Thick Film Resistors Resistance:12kΩ Tolerance:±1% Tolerance:±1% Power(Watts): Overload Voltage (Max): Temperature Coefficient:±100ppm/℃ Temperature Coefficient:±100ppm/℃ Operating Temperature Range:-55℃~+155℃ Operating Temperature Range:-55℃~+155℃; LCSC Part Name: 12kΩ ±1% 125mW 厚膜电阻; Supplier Part: C17444; Manufacturer: UNI-ROYAL(厚声); Supplier Footprint: 0805; JLCPCB Part Class: Basic Part; Datasheet: https://atta.szlcsc.com/upload/public/pdf/source/20200306/C422600_1E6D84923E4A46A82E41ADD87F860B5C.pdf; Supplier: LCSC; Type: Thick Film Resistors; Tolerance: ±1%; Temperature Coefficient: ±100ppm/℃; Operating Temperature Range: -55℃~+155℃
R16 = ERJ6ENF8873V: Type:Thick Film Resistors Resistance:887000Ω Tolerance:±1% Tolerance:±1% Power(Watts): Overload Voltage (Max):- Temperature Coefficient:±100ppm/℃ Temperature Coefficient:±100ppm/℃ Operating Temperature Range:-55℃~+155℃ Operating Temperature Range:-55℃~+15; LCSC Part Name: 887kΩ ±1% 125mW 厚膜电阻; Supplier Part: C416873; Manufacturer: PANASONIC(松下); Supplier Footprint: 0805; JLCPCB Part Class: Extended Part; Datasheet: https://atta.szlcsc.com/upload/public/pdf/source/20190902/C416873_F0E55FB954293047AECF1853D246171F.pdf; Supplier: LCSC; Type: Thick Film Resistors; Tolerance: ±1%; Temperature Coefficient: ±100ppm/℃; Operating Temperature Range: -55℃~+155℃
R17 = ERJ6ENF2942V: Type:Thick Film Resistors Resistance:29.4kΩ Tolerance:±1% Tolerance:±1% Power(Watts): Overload Voltage (Max): Temperature Coefficient:±100ppm/℃ Temperature Coefficient:±100ppm/℃ Operating Temperature Range:-55℃~+155℃ Operating Temperature Range:-55℃~+155℃; LCSC Part Name: 29.4kΩ ±1% 125mW 厚膜电阻; Supplier Part: C416836; Manufacturer: PANASONIC(松下); Supplier Footprint: 0805; JLCPCB Part Class: Extended Part; Datasheet: https://atta.szlcsc.com/upload/public/pdf/source/20190902/C416836_445F6AB694E1DC1DAAE6BC5FC4E2E18C.pdf; Supplier: LCSC; Type: Thick Film Resistors; Tolerance: ±1%; Temperature Coefficient: ±100ppm/℃; Operating Temperature Range: -55℃~+155℃
R18 = RC0805FR-0734KL: Type:Thick Film Resistors Resistance: Tolerance:±1% Tolerance:±1% Power(Watts): Overload Voltage (Max): Temperature Coefficient:±100ppm/℃ Temperature Coefficient:±100ppm/℃ Operating Temperature Range:-55℃~+155℃ Operating Temperature Range:-55℃~+155℃; LCSC Part Name: 厚膜电阻 34kΩ ±1% 125mW; Supplier Part: C273957; Manufacturer: YAGEO(国巨); Supplier Footprint: 0805; JLCPCB Part Class: Extended Part; Datasheet: https://atta.szlcsc.com/upload/public/pdf/source/20191125/C364360_EA870FADD46A2AD4DBE56DD50D360B3E.pdf; Supplier: LCSC; Type: Thick Film Resistors; Tolerance: ±1%; Temperature Coefficient: ±100ppm/℃; Operating Temperature Range: -55℃~+155℃
R19 = RC0805FR-07499KL: Type:Thick Film Resistors Resistance: Tolerance:±1% Tolerance:±1% Power(Watts): Overload Voltage (Max): Temperature Coefficient:±100ppm/℃ Temperature Coefficient:±100ppm/℃ Operating Temperature Range:-55℃~+155℃ Operating Temperature Range:-55℃~+155℃; LCSC Part Name: 厚膜电阻 499kΩ ±1% 125mW; Supplier Part: C274360; Manufacturer: YAGEO(国巨); Supplier Footprint: 0805; JLCPCB Part Class: Extended Part; Datasheet: https://atta.szlcsc.com/upload/public/pdf/source/20180821/C275644_0D56F95EFF785E7D9A1FEF436B37DA78.pdf; Supplier: LCSC; Type: Thick Film Resistors; Tolerance: ±1%; Temperature Coefficient: ±100ppm/℃; Operating Temperature Range: -55℃~+155℃
R20 = 0805W8F5602T5E: Type:Thick Film Resistors Resistance:56kΩ Tolerance:±1% Tolerance:±1% Power(Watts): Overload Voltage (Max): Temperature Coefficient:±100ppm/℃ Temperature Coefficient:±100ppm/℃ Operating Temperature Range:-55℃~+155℃ Operating Temperature Range:-55℃~+155℃; LCSC Part Name: 56kΩ ±1% 125mW 厚膜电阻; Supplier Part: C17756; Manufacturer: UNI-ROYAL(厚声); Supplier Footprint: 0805; JLCPCB Part Class: Extended Part; Datasheet: https://atta.szlcsc.com/upload/public/pdf/source/20200306/C422600_1E6D84923E4A46A82E41ADD87F860B5C.pdf; Supplier: LCSC; Type: Thick Film Resistors; Tolerance: ±1%; Temperature Coefficient: ±100ppm/℃; Operating Temperature Range: -55℃~+155℃
R22 = 0805W8F4992T5E: Type:Thick Film Resistors Resistance:49.9kΩ Tolerance:±1% Tolerance:±1% Power(Watts): Overload Voltage (Max): Temperature Coefficient:±100ppm/℃ Temperature Coefficient:±100ppm/℃ Operating Temperature Range:-55℃~+155℃ Operating Temperature Range:-55℃~+155℃; LCSC Part Name: 49.9kΩ ±1% 125mW 厚膜电阻; Supplier Part: C17719; Manufacturer: UNI-ROYAL(厚声); Supplier Footprint: 0805; JLCPCB Part Class: Extended Part; Datasheet: https://atta.szlcsc.com/upload/public/pdf/source/20200306/C422600_1E6D84923E4A46A82E41ADD87F860B5C.pdf; Supplier: LCSC; Type: Thick Film Resistors; Tolerance: ±1%; Temperature Coefficient: ±100ppm/℃; Operating Temperature Range: -55℃~+155℃
R24 = 0805W8F2432T5E: Type:Thick Film Resistors Resistance:24.3kΩ Tolerance:±1% Tolerance:±1% Power(Watts): Overload Voltage (Max): Temperature Coefficient:±100ppm/℃ Temperature Coefficient:±100ppm/℃ Operating Temperature Range:-55℃~+155℃ Operating Temperature Range:-55℃~+155℃; LCSC Part Name: 24.3kΩ ±1% 125mW 厚膜电阻; Supplier Part: C17569; Manufacturer: UNI-ROYAL(厚声); Supplier Footprint: 0805; JLCPCB Part Class: Extended Part; Datasheet: https://atta.szlcsc.com/upload/public/pdf/source/20200306/C422600_1E6D84923E4A46A82E41ADD87F860B5C.pdf; Supplier: LCSC; Type: Thick Film Resistors; Tolerance: ±1%; Temperature Coefficient: ±100ppm/℃; Operating Temperature Range: -55℃~+155℃
R25 = CR0805J80473G: Type:Thick Film Resistors Resistance: Tolerance:±5% Tolerance:±5% Power(Watts): Overload Voltage (Max): Temperature Coefficient:±200ppm/℃ Temperature Coefficient:±200ppm/℃ Operating Temperature Range:-55℃~+125℃ Operating Temperature Range:-55℃~+125℃; LCSC Part Name: 厚膜电阻 47kΩ ±5% 125mW; Supplier Part: C102018; Manufacturer: LIZ(丽智电子); Supplier Footprint: 0805; JLCPCB Part Class: Extended Part; Datasheet: https://atta.szlcsc.com/upload/public/pdf/source/20180403/C189438_6D658388CC7843F35BBC9018D03F0B8E.pdf; Supplier: LCSC; Type: Thick Film Resistors; Tolerance: ±5%; Temperature Coefficient: ±200ppm/℃; Operating Temperature Range: -55℃~+125℃
U1 = XL1509-ADJE1: Function:Step-down type Input Voltage:- Input Voltage:- Output Current (Max):- Switching Frequency:- Synchronous Rectification:- Number of Outputs:- Topology:- Switch tube (built-in/external):内置; Supplier Part: C74192; Manufacturer: XLSEMI(芯龙); Supplier Footprint: SOIC-8; JLCPCB Part Class: Extended Part; Datasheet: https://atta.szlcsc.com/upload/public/pdf/source/20160525/1464169836595.pdf; Supplier: LCSC; Function: Step-down type; Switch tube (built-in/external): 内置
U2 = B0505S-3WR2_C5369498: LCSC Part Name: DC-DC 输入电压4.5V~5.5V 输出电压5V输出功率3W600mA; Supplier Part: C5369498; Manufacturer: YLPTEC(易川); Supplier Footprint: SIP-4; JLCPCB Part Class: Extended Part; Datasheet: https://atta.szlcsc.com/upload/public/pdf/source/20230417/78355FDB466A614ED9BF545F60A618F8.pdf; Supplier: LCSC
U4 = AMS1117-3.3_C347222: Output Type: Maximum Input Voltage:12V Output Voltage:3.3V Output Voltage:3.3V MAX Output Current:1A Power Supply Rejection Ratio (PSRR):60dB@(120Hz) Dropout Voltage:1.3V@(1A) standby current:- Noise:- Feature:- Operating Temperature:- Operating Temperatu; LCSC Part Name: 输出:3.3V 电流:1A 耐压:12V; Supplier Part: C347222; Manufacturer: UMW(友台半导体); Supplier Footprint: SOT-223; JLCPCB Part Class: Extended Part; Datasheet: https://atta.szlcsc.com/upload/public/pdf/source/20231109/155D79A26D9DB04352555A58D5969DC8.pdf; Supplier: LCSC; Maximum Input Voltage: 12V; Output Voltage: 3.3V; MAX Output Current: 1A; Power Supply Rejection Ratio (PSRR): 60dB@(120Hz); Dropout Voltage: 1.3V@(1A); Output Polarity: Positive electrode; Number of Outputs: 1
U9 = TC0525B9091T5G: Type:Thin Film Resistor Resistance:9.09kΩ Tolerance:±0.1% Tolerance:±0.1% Power(Watts): Overload Voltage (Max): Temperature Coefficient:±25ppm/℃ Temperature Coefficient:±25ppm/℃; LCSC Part Name: 9.09kΩ ±0.1% 125mW 薄膜电阻; Supplier Part: C2989040; Manufacturer: UNI-ROYAL(厚声); Supplier Footprint: 0805; JLCPCB Part Class: Extended Part; Datasheet: https://atta.szlcsc.com/upload/public/pdf/source/20220725/C4EC09C3355C0FB2AA17C5E732E26A7E.pdf; Supplier: LCSC; Type: Thin Film Resistor; Tolerance: ±0.1%; Temperature Coefficient: ±25ppm/℃
U10 = TPS26630RGER: Voltage Rating:4.5V~60V Voltage Rating:4.5V~60V Operating temperature:-40℃~+125℃@(Tj) Operating temperature:-40℃~+125℃@(Tj); Supplier Part: C1850276; Manufacturer: TI(德州仪器); Supplier Footprint: VQFN-24(4x4); JLCPCB Part Class: Extended Part; Datasheet: https://www.ti.com/cn/lit/gpn/tps2663; Supplier: LCSC; Voltage Rating: 4.5V~60V; Operating temperature: -40℃~+125℃@(Tj)
C19 = CC0805KRX7R0BB472: Capacitance: Tolerance:±10% Tolerance:±10% Voltage Rated: Temperature Coefficient:; LCSC Part Name: 4.7nF ±10% 100V; Supplier Part: C282077; Manufacturer: YAGEO(国巨); Supplier Footprint: 0805; JLCPCB Part Class: Extended Part; Datasheet: https://atta.szlcsc.com/upload/public/pdf/source/20180906/C282243_51A53A5345E69C6665D4E8CFC2B98E68.pdf; Supplier: LCSC; Tolerance: ±10%
D8 = PRTR5V0U2X,215: polarity:Unidirectional Reverse Stand-Off Voltage (Vrwm):5.5V Breakdown Voltage:6V Number of Lines:双路 Operating Temperature:-40℃~+85℃@(Ta) Operating Temperature:-40℃~+85℃@(Ta) Type:ESD; LCSC Part Name: 单向ESD; Supplier Part: C12333; Manufacturer: Nexperia(安世); Supplier Footprint: SOT-143; JLCPCB Part Class: Extended Part; Datasheet: https://atta.szlcsc.com/upload/public/pdf/source/20171031/C12333_15094491572901070596.pdf; Supplier: LCSC; polarity: Unidirectional; Reverse Stand-Off Voltage (Vrwm): 5.5V; Breakdown Voltage: 6V; Number of Lines: 双路; Operating Temperature: -40℃~+85℃@(Ta); Type: ESD
R12 R13 = 0805W8F5101T5E: Type:Thick Film Resistors Resistance:5.1kΩ Tolerance:±1% Tolerance:±1% Power(Watts): Overload Voltage (Max): Temperature Coefficient:±100ppm/℃ Temperature Coefficient:±100ppm/℃ Operating Temperature Range:-55℃~+155℃ Operating Temperature Range:-55℃~+155℃; LCSC Part Name: 5.1kΩ ±1% 125mW 厚膜电阻; Supplier Part: C27834; Manufacturer: UNI-ROYAL(厚声); Supplier Footprint: 0805; JLCPCB Part Class: Basic Part; Datasheet: https://atta.szlcsc.com/upload/public/pdf/source/20200306/C422600_1E6D84923E4A46A82E41ADD87F860B5C.pdf; Supplier: LCSC; Type: Thick Film Resistors; Tolerance: ±1%; Temperature Coefficient: ±100ppm/℃; Operating Temperature Range: -55℃~+155℃
R14 = 0805W8F1004T5E: Type:Thick Film Resistors Resistance:1MΩ Tolerance:±1% Tolerance:±1% Power(Watts): Overload Voltage (Max): Temperature Coefficient:±100ppm/℃ Temperature Coefficient:±100ppm/℃ Operating Temperature Range:-55℃~+155℃ Operating Temperature Range:-55℃~+155℃; LCSC Part Name: 1MΩ ±1% 125mW 厚膜电阻; Supplier Part: C17514; Manufacturer: UNI-ROYAL(厚声); Supplier Footprint: 0805; JLCPCB Part Class: Basic Part; Datasheet: https://atta.szlcsc.com/upload/public/pdf/source/20200306/C422600_1E6D84923E4A46A82E41ADD87F860B5C.pdf; Supplier: LCSC; Type: Thick Film Resistors; Tolerance: ±1%; Temperature Coefficient: ±100ppm/℃; Operating Temperature Range: -55℃~+155℃
R15 = 0805W8F1003T5E: Type:Thick Film Resistors Resistance:100kΩ Tolerance:±1% Tolerance:±1% Power(Watts): Overload Voltage (Max): Temperature Coefficient:±100ppm/℃ Temperature Coefficient:±100ppm/℃ Operating Temperature Range:-55℃~+155℃ Operating Temperature Range:-55℃~+155℃; LCSC Part Name: 100kΩ ±1% 125mW 厚膜电阻; Supplier Part: C149504; Manufacturer: UNI-ROYAL(厚声); Supplier Footprint: 0805; JLCPCB Part Class: Basic Part; Datasheet: https://atta.szlcsc.com/upload/public/pdf/source/20200306/C422600_1E6D84923E4A46A82E41ADD87F860B5C.pdf; Supplier: LCSC; Type: Thick Film Resistors; Tolerance: ±1%; Temperature Coefficient: ±100ppm/℃; Operating Temperature Range: -55℃~+155℃
SW1 = SS-12D10G5: Circuit:Single Pole Double Throw (SPDT) Actuator Style:Rectangular column Pin Style:PCPin Switch Length:13.5mm Switch Width:6.6mm Switch Height:6.3mm Mounting Style:Direct Insert Actuator Color:Black Current Rating (DC):5A Voltage Rating (DC):125V Current; LCSC Part Name: 柄长5mm 直插双档 滑动开关; Supplier Part: C2884744; Manufacturer: XKB Connection(中国星坤); Supplier Footprint: 插件; JLCPCB Part Class: Extended Part; Datasheet: https://atta.szlcsc.com/upload/public/pdf/source/20211009/D6412F37AABE6F9459A6EE7FA4DAEADB.pdf; Supplier: LCSC; Circuit: Single Pole Double Throw (SPDT); Actuator Style: Rectangular column; Pin Style: PCPin; Switch Length: 13.5mm; Switch Width: 6.6mm; Switch Height: 6.3mm; Mounting Style: Direct Insert; Actuator Color: Black; Current Rating (DC): 5A; Voltage Rating (DC): 125V; Current Rating (AC): 5A; Voltage Rating (AC): 125V; Mechanical Life: 10000 times; Operating Temperature: -40℃~+85℃
U6 U7 = SN74LVC1G3157DBVR_C3040658: Switch Circuit:SPDT(SPDT) Number of Channels:1 Supply Voltage:1.65V~5.5V Supply Voltage:1.65V~5.5V Turn-on time:5.2ns On-State Resistance (Max):7Ω Turn-off time:3.5ns; LCSC Part Name: CMOS 低功耗 低传输延迟和低输出阻抗模拟开关; Supplier Part: C3040658; Manufacturer: UMW(友台半导体); Supplier Footprint: SOT-23-6; JLCPCB Part Class: Extended Part; Datasheet: https://atta.szlcsc.com/upload/public/pdf/source/20231109/79313A8EB0DDA0812F5495A9B82306A6.pdf; Supplier: LCSC; Switch Circuit: SPDT(SPDT); Number of Channels: 1; Supply Voltage: 1.65V~5.5V; Turn-on time: 5.2ns; On-State Resistance (Max): 7Ω; Turn-off time: 3.5ns
USB1 = TYPE-C16PIN: Connector Type:Type-C Standard:- Gender:Female Number of Ports:1 Number of Contacts:16P Mounting Style:卧贴 Current Rating - Power (Max):3A Operating Temperature Range:-40℃~+85℃ Operating Temperature Range:-40℃~+85℃; LCSC Part Name: Type-C 母 卧贴; Supplier Part: C393939; Manufacturer: SHOU HAN(首韩); Supplier Footprint: SMD; JLCPCB Part Class: Extended Part; Datasheet: https://atta.szlcsc.com/upload/public/pdf/source/20190521/C393939_7B9043D4CF1026AF443AB60D91FBCD5C.pdf; Supplier: LCSC; Connector Type: Type-C; Gender: Female; Number of Ports: 1; Number of Contacts: 16P; Mounting Style: 卧贴; Current Rating - Power (Max): 3A; Operating Temperature Range: -40℃~+85℃

## Nets
3V3: C12.1 C14.2 C28.2 C30.2 C50.1 C51.2 C52.2 C53.2 R26.2 R27.2 R54.1 U4.4(TAB) U11.2(3V3) U16.14(VCC) U17.52
+5V: C6.2 C11.1 C13.2 C20.2 C21.2 D9.1(-) D12.1(-) SW1.3 U2.1(VIN) U4.3(VIN) U6.5(VCC) U7.5(VCC) ; also on sheet 4
+5V(ISO): C8.2 C10.2 U2.6(+VO)
AVDD_LCD: U17.43 ; also on sheet 4
GND: C1.2 C2.1 C3.2 C4.1 C5.1 C6.1 C11.2 C12.2 C13.1 C14.1 C19.1 C20.1 C21.1 C22.1 C23.1 C25.1 C26.2 C27.1 C28.1 C29.1 C30.1 C50.2 C51.1 C52.1 C53.1 CN2.1 D5.2(A) D10.1 D11.2(A) LED2.1(K) R3.1 R12.1 R13.1 R14.1 R15.2 R18.1 R20.1 R25.1 R55.1 R58.1 SW1.1 SW2.1 SW3.1 U1.5(GND) U1.6(GND) U1.7(GND) U1.8(GND) U2.2(GND) U4.1(ADJ(GND)) U6.2(GND) U7.2(GND) U9.1 U10.8(GND) U10.11(MODE) U10.25(EP) U11.1(GND) U11.40(GND) U11.41(GND) U16.7(GND) U17.5 U17.17 U17.18 U17.19 U17.26 U17.27 U17.33 U17.34 U17.35 U17.36 U17.38 U17.48 U17.53 U17.57 U17.58 USB1.A1B12(GND) USB1.B1A12(GND) ; also on sheet 4
GND(ISO): C8.1 C10.1 U2.4(0V)
VBUS: C22.2 D8.4(VCC) D9.2(+) USB1.A4B9(VBUS) USB1.B4A9(VBUS)
B3: U11.22(IO14) U17.16
B4: U11.31(IO38) U17.15
B5: U11.11(IO18) U17.14
B6: U11.10(IO17) U17.13
B7: U11.18(IO10) U17.12
BL_EN: R50.1 ; also on sheet 4
BOOT: R27.1 SW3.2
CC1: R12.2 USB1.A5(CC1)
CC2: R13.2 USB1.B5(CC2)
CTP_IRQ: U11.4(IO4) U17.54
CTP_RST: R51.1 U17.51
CTP_SCL: U11.17(IO9) U16.5(SCL) U17.56
CTP_SDA: U11.12(IO8) U16.6(SDA) U17.55
DE: U11.5(IO5) U17.9
ENABLE: C29.2 R26.1 SW2.2 U11.3(EN)
ESP_N: U7.3(B0)
ESP_P: U6.3(B0)
ESP_USB_N: U11.13(IO19)
ESP_USB_P: U11.14(IO20)
EXTIO3: R49.1 R59.1 U17.44
EXTIO6: R48.2 ; also on sheet 4
FLT#: R22.1 U10.14(FLT#)
G2: U11.32(IO39) U17.25
G3: U11.27(IO0) U17.24
G4: U11.26(IO45) U17.23
G5: U11.25(IO48) U17.22
G6: U11.24(IO47) U17.21
G7: U11.23(IO21) U17.20
HSYNC: U11.16(IO46) U17.11
IO1: U11.39(IO1) U17.32
IO2: U11.38(IO2) U17.31
IO3: U11.15(IO3) U17.10
IO7: U11.7(IO7) U17.37
IO11: U11.19(IO11)
IO12: U11.20(IO12)
IO13: U11.21(IO13)
IO15: U11.8(IO15)
IO16: U11.9(IO16)
IO40: U11.33(IO40) U17.28
IO41: U11.34(IO41) U17.29
IO42: U11.35(IO42) U17.30
LCD_VDD: R53.1 R54.2 R56.1 R57.1 R59.2 U17.7
OUT: D5.1(K) L1.1 U1.2(OUT)
PGOOD: LED2.2(A) R24.1 U10.16(PGOOD)
PGTH: R19.1 R20.2 U10.15(PGTH)
RA4_N: U7.1(B1)
RA4_P: U6.1(B1)
RXD0: U11.36(RXD0)
SHELL: C19.2 D8.1(GND) R14.2 USB1.1(SHELL)
TXD0: U11.37(TXD0)
USB_D_N: D8.3(IO2) U7.4(A) USB1.A7(DN1) USB1.B7(DN2)
USB_D_P: D8.2(IO1) U6.4(A) USB1.A6(DP1) USB1.B6(DP2)
VCOM: U17.6 U17.46 ; also on sheet 4
VGH: U17.41 ; also on sheet 4
VGL: U17.42 ; also on sheet 4
VLED+: U17.1 U17.2 ; also on sheet 4
VLED-: U17.3 U17.4 ; also on sheet 4
$1N22653: R16.1 R17.2 U10.6(UVLO)
$1N22664: R17.1 R18.2 U10.7(OVP)
$1N22694: C27.2 U10.9(dVdT)
$1N22706: U9.2 U10.10(ILIM)
$1N23130: Q2.1(G) U10.4(DRV)
$1N23141: Q1.4(G) Q2.3(D) U10.3(B_GATE)
$1N23798: LED1.1(K) R22.2
$1N24032: C23.2 CN2.2 D10.2 LED1.2(A) Q1.1(S) Q1.2(S) Q1.3(S) Q1.5(D) Q1.6(D) Q1.7(D) Q1.8(D) Q1.9(D) Q2.2(S) R16.2 U10.1(IN) U10.2(IN) U10.5(IN_SYS)
$1N30506: C1.1 C2.2 C25.2 C26.1 D11.1(K) R19.2 R24.2 U1.1(VIN) U10.17(OUT) U10.18(OUT)
$1N31238: C7.1 R2.1 R3.2 U1.3(FB)
$1N31847: R25.2 U1.4(ON/OFF)
$1N32010: C3.1 C4.2 C5.2 C7.2 D12.2(+) L1.2 R2.2
$2N3880: R48.1 U16.3(IO6)
$2N3919: R49.2 U16.16(IO3)
$2N3958: R50.2 U16.15(IO2)
$2N3997: R51.2 U16.13(IO1)
$2N4760: R52.1 U17.47
$3N2530: R15.1 SW1.2 U6.6(SEL) U7.6(SEL)
Net-(R53-2): R53.2 U17.8
Net-(R55-2): R55.2 R56.2 U17.39
Net-(R57-2): R57.2 R58.2 U17.40

Not connected (* = marked no-connect by the designer): R52 2; U4 2(VOUT(TAB))*; U10 12(SHDN#)* 13(IMON)* 19(N.C.)* 20(N.C.)* 21(N.C.)* 22(N.C.)* 23(N.C.)* 24(N.C.)*; U11 6(IO6)* 28(IO35)* 29(IO36)* 30(IO37)*; U16 1(IO4)* 2(IO5)* 4(IO7)* 8(OC0)* 9(OC1)* 10(OC2)* 11(OC3)* 12(IO0)*; U17 45* 49* 50*; USB1 2(SHELL)* 3(SHELL)* 4(SHELL)* A8(SBU1)* B8(SBU2)*

## Notes on the sheets
sheet 1
- Buck Convertor
- Input : 4.5VDC - 40VDC(UV - 18V & OV - 33V & Current Limit - 2A)
- Output : 5VDC 2A
- Isolated 5V
- LDO
- Input : 5V 2A
- Output : 3.3V 1A
sheet 2
- USB
- LCD
- LCD touchscreen
sheet 3
- USB Type-C
- ESD-Protection
- Programmer Switch (ESP32-RA4M1)
- 1 - ESP32 (Default to ground)
- 3 - R7FA4M1 (Pull high)
